# EAGLE design Ahoura_Blinky (EAGLE 8.3.2)
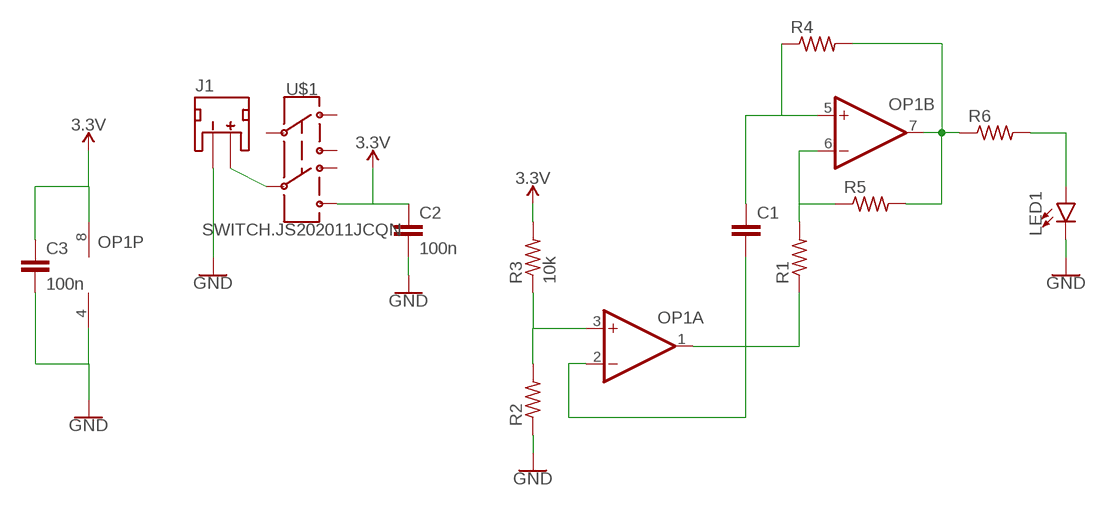
[diagram p0: schematic, sheet 1]

## Parts
C1  CAPACITOR0402  [C0402]
C2  100n  CAPACITOR0402  [C0402]
C3  100n  CAPACITOR0402  [C0402]
J1  JST_2MM_MALE  [JST-2-SMD]
LED1  LED0603  [LED-0603]
OP1  OP-DUALRM  [MSOP08]
R1  RESISTOR0402  [R0402]
R2  RESISTOR0402  [R0402]
R3  10k  RESISTOR0402  [R0402]
R4  RESISTOR0402  [R0402]
R5  RESISTOR0402  [R0402]
R6  RESISTOR0402  [R0402]
U$1  SWITCH.JS202011JCQN  [SWITCH.00]

## Nets
3.3V: C2.1 C3.1 OP1.8(P:V+) R3.2 U$1.7
GND: C2.2 C3.2 J1.1(-) LED1.C OP1.4(P:V-) R2.1
N$1: J1.2(+) U$1.6
N$3: OP1.7(B:OUT) R4.2 R5.2 R6.1
N$4: OP1.3(A:+IN) R2.2 R3.1
N$7: C1.2 OP1.1(A:OUT) OP1.2(A:-IN) R1.1
N$8: C1.1 OP1.5(B:+IN) R4.1
N$9: OP1.6(B:-IN) R1.2 R5.1
N$12: LED1.A R6.2
Unconnected: J1.NC1(PAD1) J1.NC2(PAD2) U$1.1 U$1.2 U$1.3 U$1.5

## Library data of the parts
C1-C3 = CalvEngIO-Passives:CAPACITOR
J1 = CalvEngIO-Connectors:JST_2MM_MALE: JST 2MM MALE RA CONNECTOR Two pin, compact surface mount connector. Commonly used as a battery input connection point. We really like the solid locking feeling and high current rating on these small connectors. We use these all the time as battery connectors. Mates to single-cell LiPo batteries. Here is the connector we sell at SparkFun: JST Right Angle Connector - White <https://www.sparkfun.com/products/8612> (PRT-08612) Datasheet <http://www.sparkfun.com/datasheets/Prototyping/Connectors/JST-Horizontal.pdf> It was used on these SparkFun products: SparkFun MOSFET Power Controller <https://www.sparkfun.com/products/11214> (PRT-11214) SparkFun Battery Babysitter - LiPo Battery Manager <https://www.sparkfun.com/products/13777> (PRT-13777) And many, many others that required a lipo battery connection.; PROD_ID: CONN-11443; SF_ID: PRT-08612
LED1 = CalvEngIO-LED:LED: LED (Generic) Standard schematic elements and footprints for 5mm, 3mm, 1206, and 0603 sized LEDs. Generic LEDs with no color specified. LTST-C190KGKT: arrow indicates cathode
OP1 = CalvEngIO-AnalogIC:OP-DUAL: Precision Micropower, Low Noise CMOS, Rail-to-Rail Input/Output Operational Amplifiers Source: http://www.analog.com/static/imported-files/data_sheets/AD8603_8607_8609.pdf; MF: ALTERA CORPORATION; MPN: AD8607ARMZ-REEL; OC_FARNELL: 1464990; OC_NEWARK: 59K6925
R1-R6 = CalvEngIO-Passives:RESISTOR
U$1 = CalvEngIO-Switches:SWITCH.JS202011JCQN

## Board
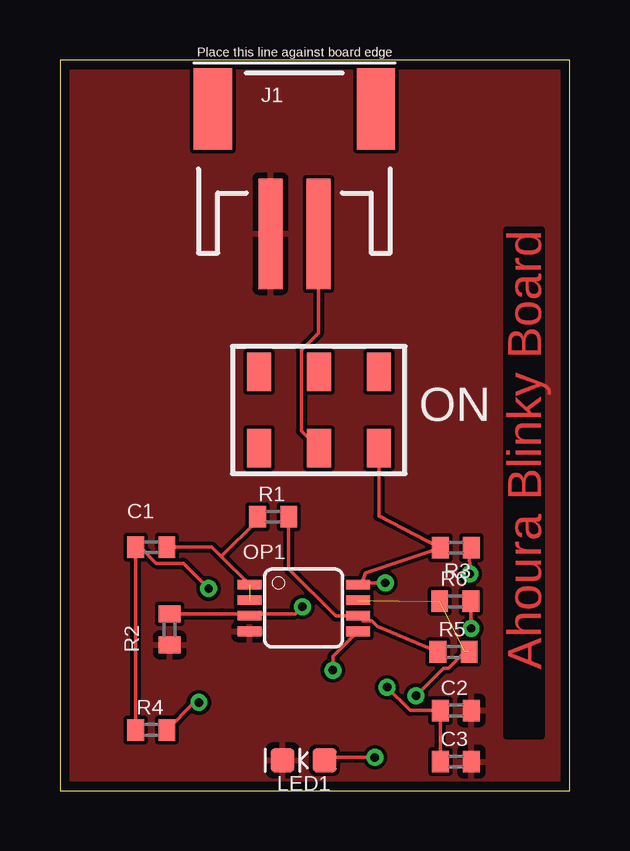
[diagram p1: board, top side]
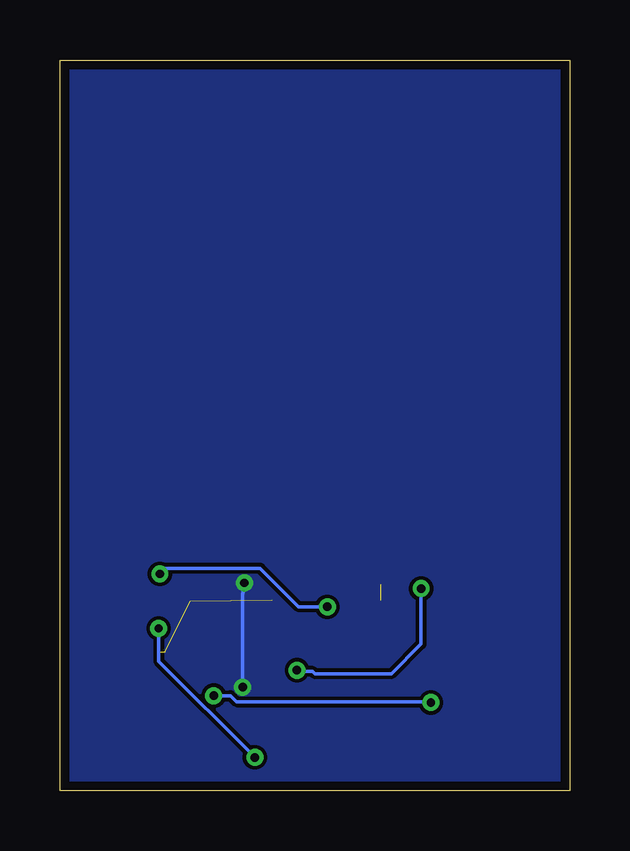
[diagram p2: board, bottom side, seen from below]

Size 21.26 x 30.47 mm. Coordinates in mm from the lower left corner, seen from the top.
Outline: 0,0 21.26,0 21.26,30.47 0,30.47 0,0
Copper layers (1*16): Top 0.0356mm / dielectric 1.5011mm / Bottom 0.0356mm
Design rules "LaenPCBOrder": minimum track width 6mil, minimum drill 13mil, track to track 6mil, track to pad 6mil, pad to pad 6mil, via to via 6mil, smd to smd 6mil, copper to edge 15mil, drill to drill 6mil, minimum pad ring 7mil, minimum via ring 7mil, stop-mask expansion 3mil, vias tented up to drill 0mil, thermal gap 10mil

### Footprints (pad centres in the part's own frame; a part is rotated, then mirrored left to right if it is on the bottom)
C0402 = smd 0.7 x 0.9: 1 -0.65,0; 2 0.65,0
JST-2-SMD = smd 1 x 4.6: 1 -1,-3.7; 2 1,-3.7 | smd 1.6 x 3.4: NC1 -3.4,1.5; NC2 3.4,1.5
LED-0603 = smd 1 x 1: A -0.877,0; C 0.877,0
MSOP08 = smd 0.4 x 1: 1 -0.976,-2.263; 2 -0.326,-2.263; 3 0.324,-2.263; 4 0.974,-2.263; 5 0.974,2.262; 6 0.324,2.262; 7 -0.326,2.262; 8 -0.976,2.262
R0402 = smd 0.7 x 0.9: 1 -0.65,0; 2 0.65,0
SWITCH.00 = smd 1 x 1.6: 1 -2.5,1.6; 2 0,1.6; 3 2.5,1.6; 5 -2.5,-1.6; 6 0,-1.6; 7 2.5,-1.6

### Placement (x,y rotation side)
C1  3.81,10.16 0 top
C2  16.51,3.35 0 top
C3  16.51,1.22 0 top
J1  9.78,26.92 0 top
LED1  10.16,1.27 180 top
OP1  10.16,7.62 270 top
R1  8.89,11.43 0 top
R2  4.57,6.73 90 top
R3  16.51,10.13 180 top
R4  3.81,2.54 0 top
R5  16.41,5.79 0 top
R6  16.48,7.9 0 top
U$1  10.79,15.88 0 top

### Tracks (layer width: path | path; a pad name or v marks a point on that pad's centre or on a via)
3.3V  (via drill 0.35)
  Top 0.152: U$1.7 13.29,11.46 R3.2 12.75,9.08 12.57,8.6 | C3.1 C2.1 14.61,3.35 v13.64,4.32 | 12.57,8.6 OP1.8 | v13.56,8.67 12.64,8.67 12.57,8.6
  Bottom 0.152: v13.64,4.32 13.64,8.19 v13.56,8.67
  pour Bottom: -0.38,30.86 -0.38,-0.33 -0.43,-0.38 21.97,-0.38 22.02,-0.33 22.02,30.71 21.87,30.86
GND
  pour Top: -0.28,30.73 -0.28,-0.58 21.67,-0.58 21.82,-0.43 21.82,30.73 21.67,30.89 0.1,30.89 -0.18,30.89 -0.28,30.78
N$1
  Top 0.152: J1.2 10.78,19.08 10.07,18.37 10.07,15 U$1.6
N$3  (via drill 0.35)  (3 unrouted)
  Top 0.152: v14.85,3.97 15.99,5.11 16.2,5.11 16.88,5.79 | v5.79,3.68 5.6,3.68 R4.2
  Bottom 0.152: v14.85,3.97 14.15,3.97 13.89,3.71 5.82,3.71 v5.79,3.68
N$4  (via drill 0.35)
  Top 0.152: 7.81,7.38 OP1.3 | R2.2 6.76,7.38 7.81,7.38 | 7.81,7.38 9.82,7.38 v10.11,7.67 | v17.09,9.04 17.07,10.04 R3.1
  Bottom 0.152: v10.11,7.67 11.3,7.67 12.91,9.27 16.89,9.27 v17.09,9.04
N$7  (1 unrouted)
  Top 0.152: C1.2 6.33,10.16 6.73,9.76 | 6.73,9.76 OP1.1 | R1.1 8.24,11.28 6.73,9.76
N$8  (via drill 0.35)
  Top 0.152: R4.1 C1.1 3.34,10.16 4.01,9.48 5.15,9.48 v6.2,8.43 | v11.38,5.03 11.38,5.6 OP1.5
  Bottom 0.152: v6.2,8.43 6.2,6.12 7.44,4.88 10.62,4.88 10.72,4.98 11.33,4.98 v11.38,5.03
N$9
  Top 0.152: 12.45,7.27 OP1.6 | 12.45,7.27 12.64,7.08 13.02,7.08 13.23,6.86 R5.1 | 12.45,7.27 OP1.6 11.51,7.29 9.54,9.26 R1.2
N$12  (via drill 0.35)
  Top 0.152: R6.2 17.14,6.78 v17.14,6.77 | v13.13,1.39 11.16,1.39 LED1.A
  Bottom 0.152: v17.14,6.77 17.14,5.41 v13.13,1.39

### Text on the board
Top: Ahoura Blinky Board
tPlace: ON